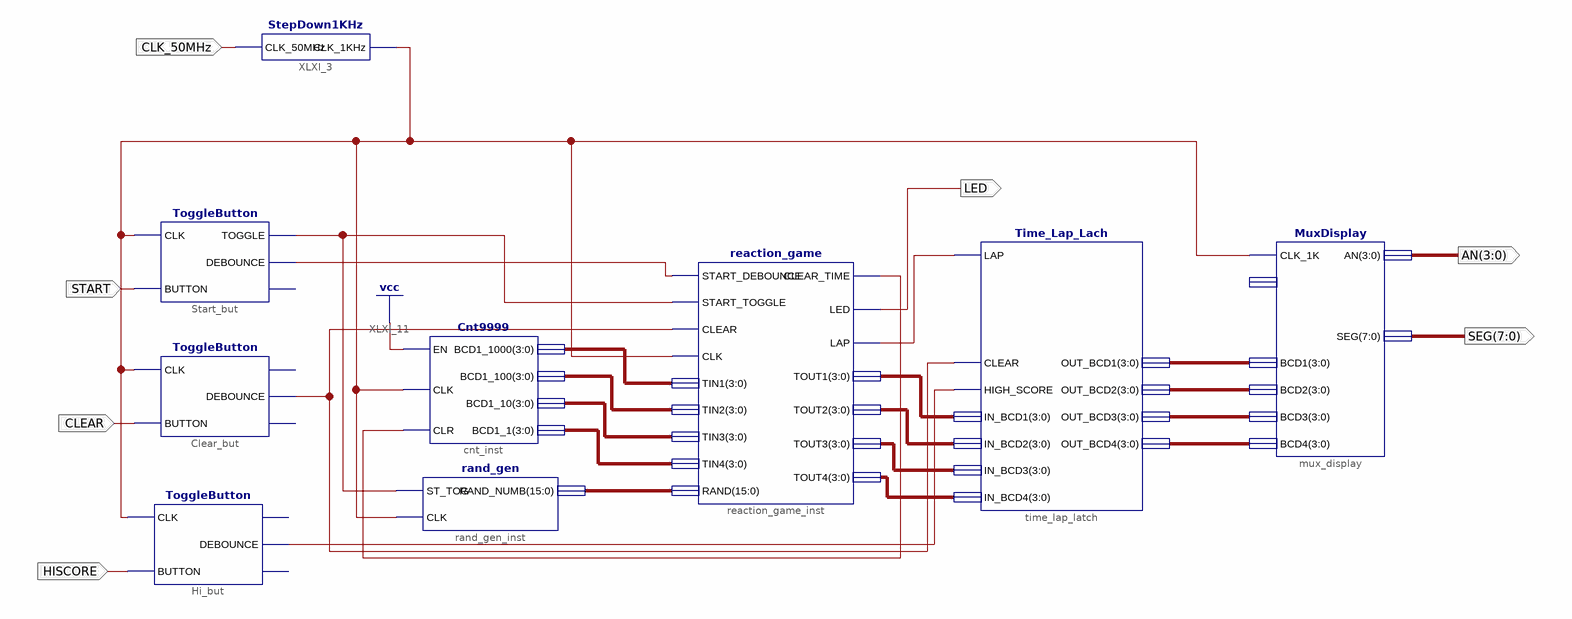
[diagram p0: schematic sheet 1]
// Xilinx ISE schematic Reaction_game_ass.sch (spartan3e) as structural Verilog: 9 symbols, 7 ports
module Reaction_game_ass (
  input  HISCORE,
  input  CLEAR,
  input  START,
  input  CLK_50MHz,
  output [3:0] AN,
  output [7:0] SEG,
  output LED
);

  wire CLK_1KHz, XLXN_50, XLXN_61, XLXN_63, XLXN_64, XLXN_65, XLXN_66;
  wire [3:0] XLXN_1, XLXN_2, XLXN_3, XLXN_4, XLXN_11, XLXN_12, XLXN_13, XLXN_14, XLXN_19, XLXN_20, XLXN_26,
       XLXN_33;
  wire [15:0] XLXN_10;

  Cnt9999 cnt_inst (
    .EN(1'b1), .CLK(CLK_1KHz), .CLR(XLXN_65), .BCD1_1000(XLXN_11), .BCD1_100(XLXN_12), .BCD1_10(XLXN_13),
    .BCD1_1(XLXN_14));
  MuxDisplay mux_display (
    .CLK_1K(CLK_1KHz), .BCD1(XLXN_1), .BCD2(XLXN_2), .BCD3(XLXN_3), .BCD4(XLXN_4), .AN(AN), .SEG(SEG));  // open: DOTS
  Time_Lap_Lach time_lap_latch (
    .LAP(XLXN_50), .CLEAR(XLXN_64), .HIGH_SCORE(XLXN_66), .IN_BCD1(XLXN_33), .IN_BCD2(XLXN_26),
    .IN_BCD3(XLXN_20), .IN_BCD4(XLXN_19), .OUT_BCD1(XLXN_1), .OUT_BCD2(XLXN_2), .OUT_BCD3(XLXN_3),
    .OUT_BCD4(XLXN_4));
  ToggleButton Start_but (.CLK(CLK_1KHz), .BUTTON(START), .TOGGLE(XLXN_61), .DEBOUNCE(XLXN_63));  // open: PULSE
  ToggleButton Clear_but (.CLK(CLK_1KHz), .BUTTON(CLEAR), .DEBOUNCE(XLXN_64));  // open: TOGGLE, PULSE
  ToggleButton Hi_but (.CLK(CLK_1KHz), .BUTTON(HISCORE), .DEBOUNCE(XLXN_66));  // open: TOGGLE, PULSE
  rand_gen rand_gen_inst (.ST_TOG(XLXN_61), .CLK(CLK_1KHz), .RAND_NUMB(XLXN_10));
  reaction_game reaction_game_inst (
    .START_DEBOUNCE(XLXN_63), .START_TOGGLE(XLXN_61), .CLEAR(XLXN_64), .CLK(CLK_1KHz), .TIN1(XLXN_11),
    .TIN2(XLXN_12), .TIN3(XLXN_13), .TIN4(XLXN_14), .RAND(XLXN_10), .CLEAR_TIME(XLXN_65), .LED(LED),
    .LAP(XLXN_50), .TOUT1(XLXN_33), .TOUT2(XLXN_26), .TOUT3(XLXN_20), .TOUT4(XLXN_19));
  StepDown1KHz XLXI_3 (.CLK_50MHz(CLK_50MHz), .CLK_1KHz(CLK_1KHz));
endmodule
